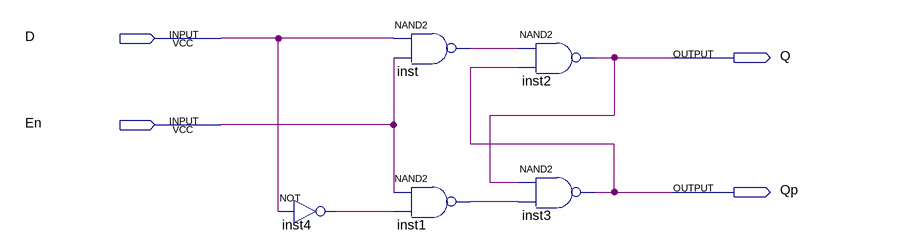
[diagram p0: schematic sheet]
// Quartus schematic pre_made.bdf as structural Verilog: 5 symbols, 4 pins
module pre_made (
  input  D,
  input  En,
  output Q,
  output Qp
);

  wire inst1_out, inst4_out, inst_out;

  not inst4 (inst4_out, D);
  nand inst (inst_out, D, En);
  nand inst1 (inst1_out, En, inst4_out);
  nand inst2 (Q, inst_out, Qp);
  nand inst3 (Qp, Q, inst1_out);
endmodule
